# Altium project MicPreAmp.PrjPCB
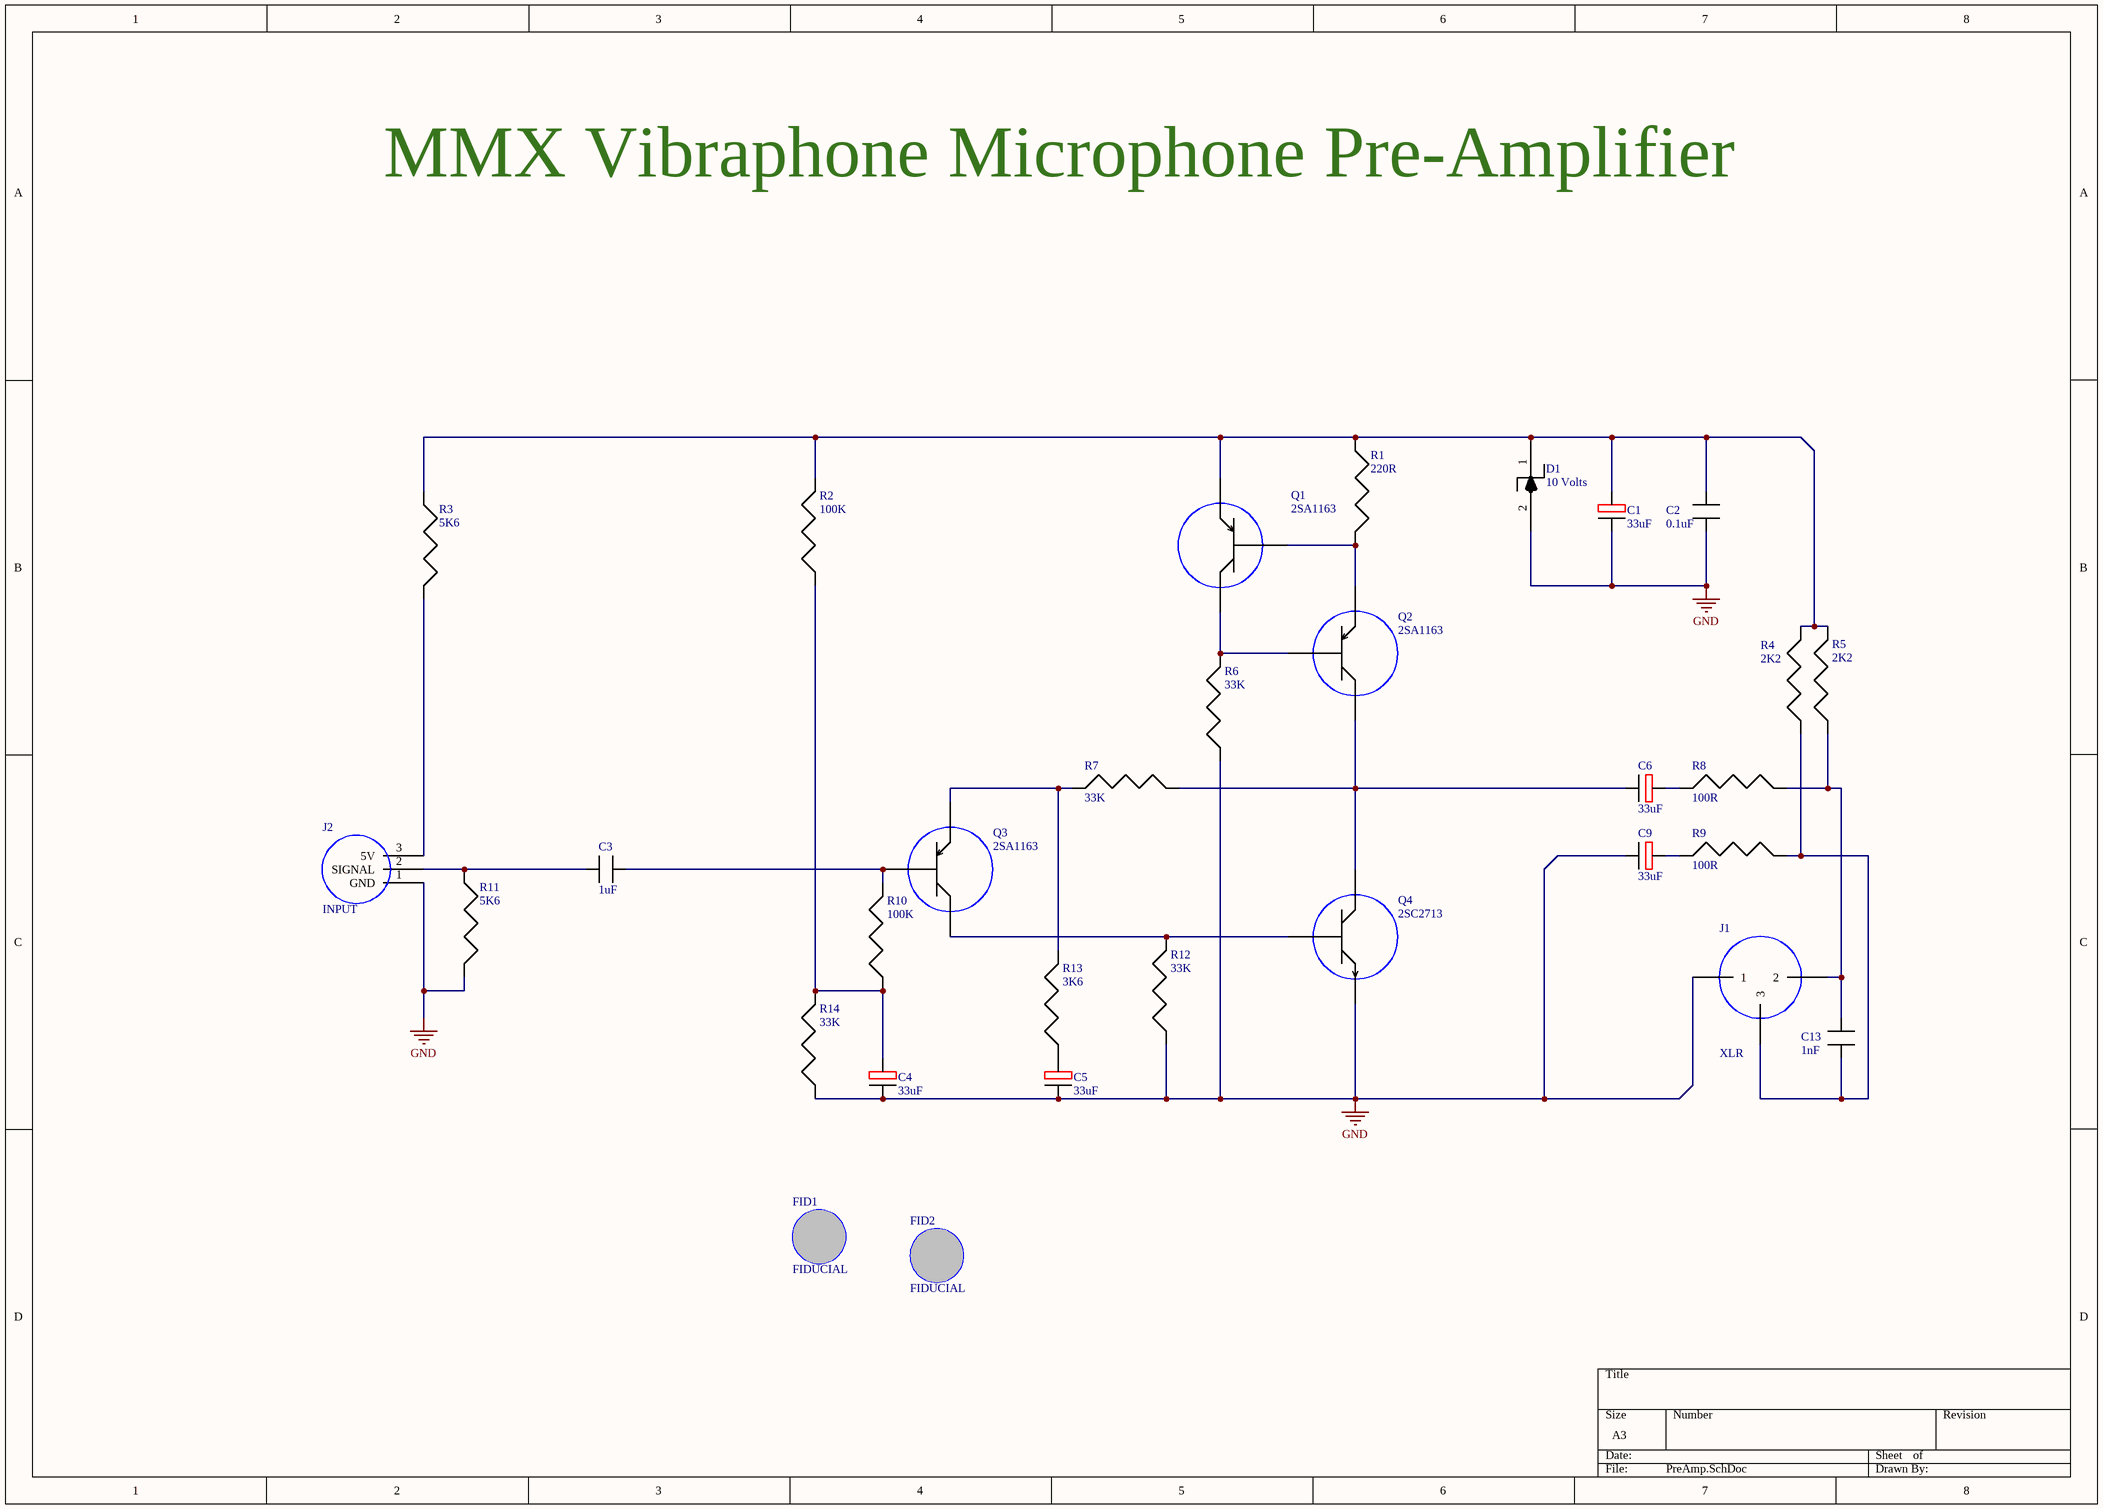
[diagram p0: PreAmp.SchDoc]
1 sheet, 31 parts. Net scope: global (net labels, ports and power ports of the same name join across sheets).
Board file: MicAmp.PcbDoc

## Sheet PreAmp.SchDoc
size A3

### Parts
C1  33uF  [UFW1J330MED]
C2  0.1uF  [C0805]
C3  1uF  [C1210]
C4  33uF  [UFW1J330MED]
C5  33uF  [UFW1J330MED]
C6  33uF  [UFW1J330MED]
C9  33uF  [UFW1J330MED]
C13  1nF  [C0805]
D1  10 Volts  [SOD80C]
FID1  FIDUCIAL  [FIDUCIAL]
FID2  FIDUCIAL  [FIDUCIAL]
J1  XLR  [XLR]
J2  INPUT  [INPUT]
Q1  2SA1163  [TO-236/SC-59/SOT-23]
Q2  2SA1163  [TO-236/SC-59/SOT-23]
Q3  2SA1163  [TO-236/SC-59/SOT-23]
Q4  2SC2713  [TO-236/SC-59/SOT-23]
R1  220R  [MMA0204]
R2  100K  [MMA0204]
R3  5K6  [MMA0204]
R4  2K2  [MMA0204]
R5  2K2  [MMA0204]
R6  33K  [MMA0204]
R7  33K  [MMA0204]
R8  100R  [MMA0204]
R9  100R  [MMA0204]
R10  100K  [MMA0204]
R11  5K6  [MMA0204]
R12  33K  [MMA0204]
R13  3K6  [MMA0204]
R14  33K  [MMA0204]

### Nets
GND: C1.2(-) C2.2 C4.2(-) C5.2(-) C9.2(-) D1.2(A) J1.1 J2.1(GND) Q4.2(E) R6.1 R11.2 R12.1 R14.1
NetC1_1: C1.1(+) C2.1 D1.1(K) Q1.2(E) R1.1 R2.2 R3.1 R4.2 R5.2
NetC3_1: C3.1 J2.2(SIGNAL) R11.1
NetC3_2: C3.2 Q3.1(B) R10.2
NetC4_1: C4.1(+) R2.1 R10.1 R14.2
NetC5_1: C5.1(+) R13.1
NetC6_1: C6.1(+) R8.1
NetC6_2: C6.2(-) Q2.3(C) Q4.3(C) R7.2
NetC9_1: C9.1(+) R9.1
NetC13_1: C13.1 J1.2 R5.1 R8.2
NetC13_2: C13.2 J1.3 R4.1 R9.2
NetJ2_3: J2.3(5V) R3.2
NetQ1_1: Q1.1(B) Q2.2(E) R1.2
NetQ1_3: Q1.3(C) Q2.1(B) R6.2
NetQ3_2: Q3.2(E) R7.1 R13.2
NetQ3_3: Q3.3(C) Q4.1(B) R12.2

### Notes on the sheet
- MMX Vibraphone Microphone Pre-Amplifier

### Library data of the parts
C1 C4-C6 C9 = CE
C2 C3 C13 = C
D1 = BZV55B10
Q1-Q3 = PNP
Q4 = NPN
R1-R14 = Resistor
  R1: Resistance: 220R
  R2 R10: Resistance: 100K
  R3 R11: Resistance: 5K6
  R4 R5: Resistance: 2K2
  R6 R7 R12 R14: Resistance: 33K
  R8 R9: Resistance: 100R
  R13: Resistance: 3K6